# EAGLE design I2CSlave_OnBoard (EAGLE 8.3.1)
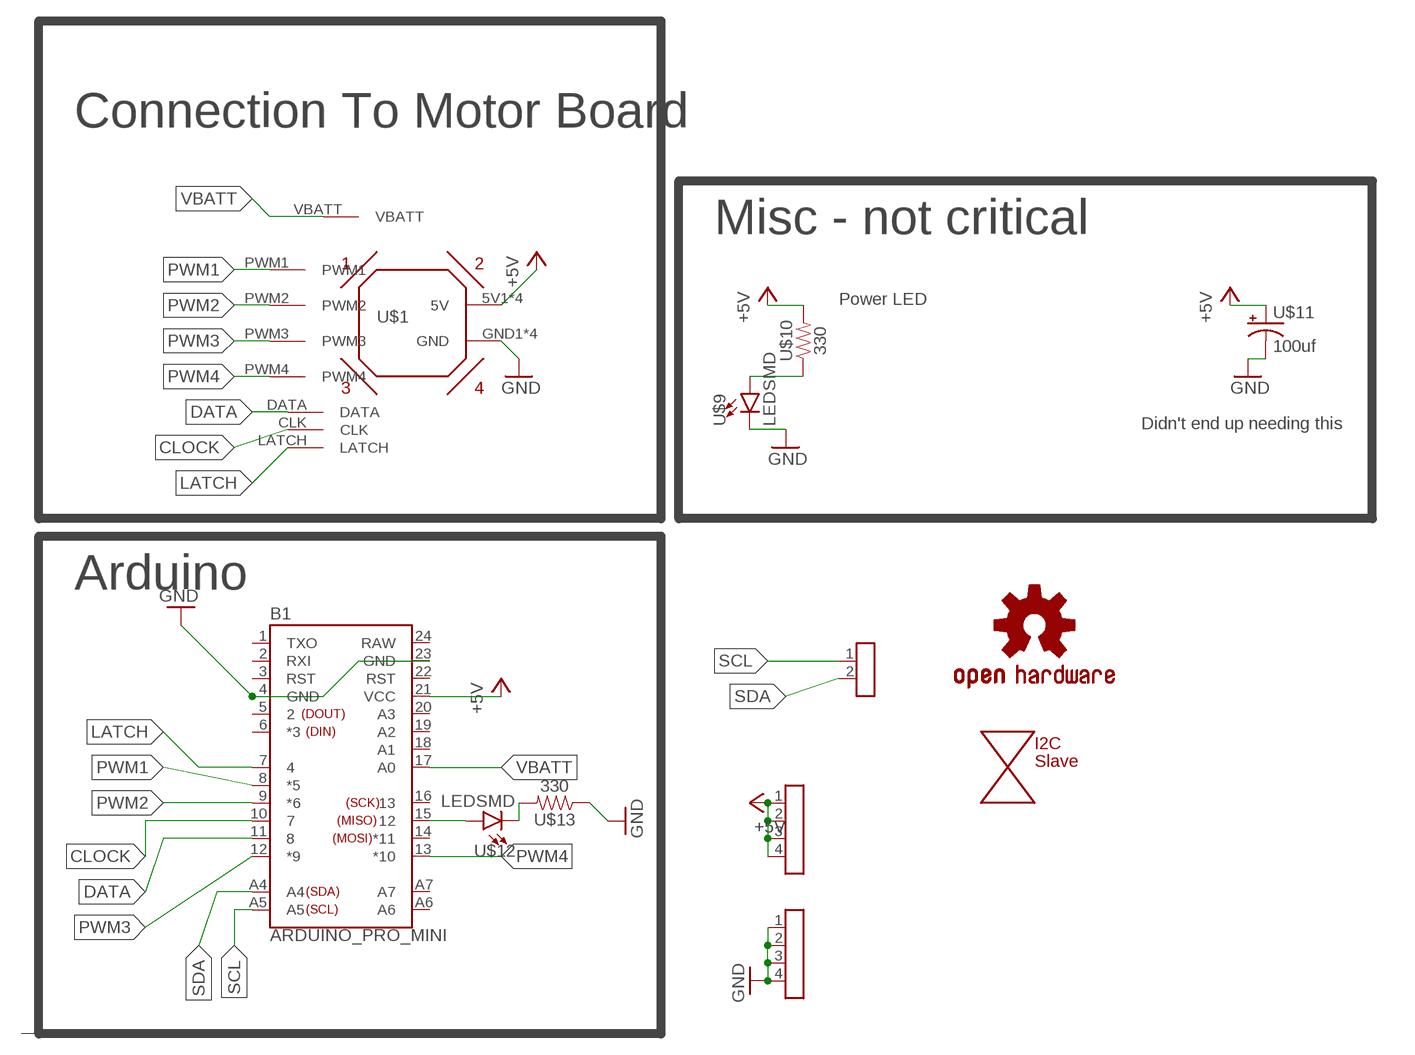
[diagram p0: schematic, sheet 1]

## Parts
B1  ARDUINO_PRO_MINI  [ARDUINO_PRO_MINI]
I2C  Slave  ANNOTATION  [ANNOTATION]
LOGO1  OSHW-LOGOM  [OSHW-LOGO-M]
U$1  OMNIBOARD  [OMNIBOARD]
U$2  2XHEADER  [2XHEADER]
U$3  4XHEADER  [4XHEADER]
U$4  4XHEADER  [4XHEADER]
U$9  LEDSMD  [LED_SMD]
U$10  330  RESISTORSMD  [R1206]
U$11  100uf  CAP_EMED  [CAP_E]
U$12  LEDSMD  [LED_SMD]
U$13  330  RESISTORSMD  [R1206]

## Nets
+5V [pow]: B1.21(VCC) U$1.5V1(5V) U$1.5V2(5V) U$1.5V3(5V) U$1.5V4(5V) U$3.1 U$3.2 U$3.3 U$3.4 U$10.2 U$11.+
CLOCK: B1.10 U$1.CLK
DATA: B1.11 U$1.DATA
GND [pow]: B1.4(GND) B1.23(GND) U$1.GND1(GND) U$1.GND2(GND) U$1.GND3(GND) U$1.GND4(GND) U$4.1 U$4.2 U$4.3 U$4.4 U$9.C U$11.- U$13.1
LATCH: B1.7 U$1.LATCH
N$1: U$9.A U$10.1
N$2: B1.15 U$12.A
N$5: U$12.C U$13.2
PWM1: B1.8(*5) U$1.PWM1
PWM2: B1.9(*6) U$1.PWM2
PWM3: B1.12(*9) U$1.PWM3
PWM4: B1.13(*10) U$1.PWM4
SCL: B1.A5 U$2.1
SDA: B1.A4 U$2.2
VBATT: B1.17(A0) U$1.VBATT
Unconnected: B1.1(TXO) B1.2(RXI) B1.3(RST) B1.5 B1.6(*3) B1.14(*11) B1.16 B1.18(A1) B1.19(A2) B1.20(A3) B1.22(RST) B1.A6 B1.A7

## Notes on the sheet
- Connection To Motor Board
- Misc - not critical
- Power LED
- Didn't end up needing this
- Arduino

## Power pins joined to a net without a drawn wire
RAW: B1.24(RAW)

## Library data of the parts
B1 = Richard_Micros:ARDUINO_PRO_MINI: SparkFun Pro Mini Pro Mini compatible footprint. Dimensions: 0.7 x 1.3" PCB Thickness: 0.8mm SparkFun Products: 3.3V/8MHz <https://www.sparkfun.com/products/11114> 5V/16MHz <https://www.sparkfun.com/products/11113>
I2C = Richard_Symbols:ANNOTATION
LOGO1 = Richard_Symbols:OSHW-LOGO: Open-Source Hardware (OSHW) Logo This logo indicates the piece of hardware it is found on incorporates a OSHW license and/or adheres to the definition of open source hardware found here: http://freedomdefined.org/OSHW
U$1 = Richard:OMNIBOARD
U$2 = Richard_Headers:2XHEADER
U$3 U$4 = Richard_Headers:4XHEADER
U$9 U$12 = Richard_Components:LED
U$10 U$13 = Richard_Components:RESISTOR
U$11 = Richard_Components:CAP_E

## Net classes
0 default: width 0.254 mm
1 pow: width 0.508 mm

## Board
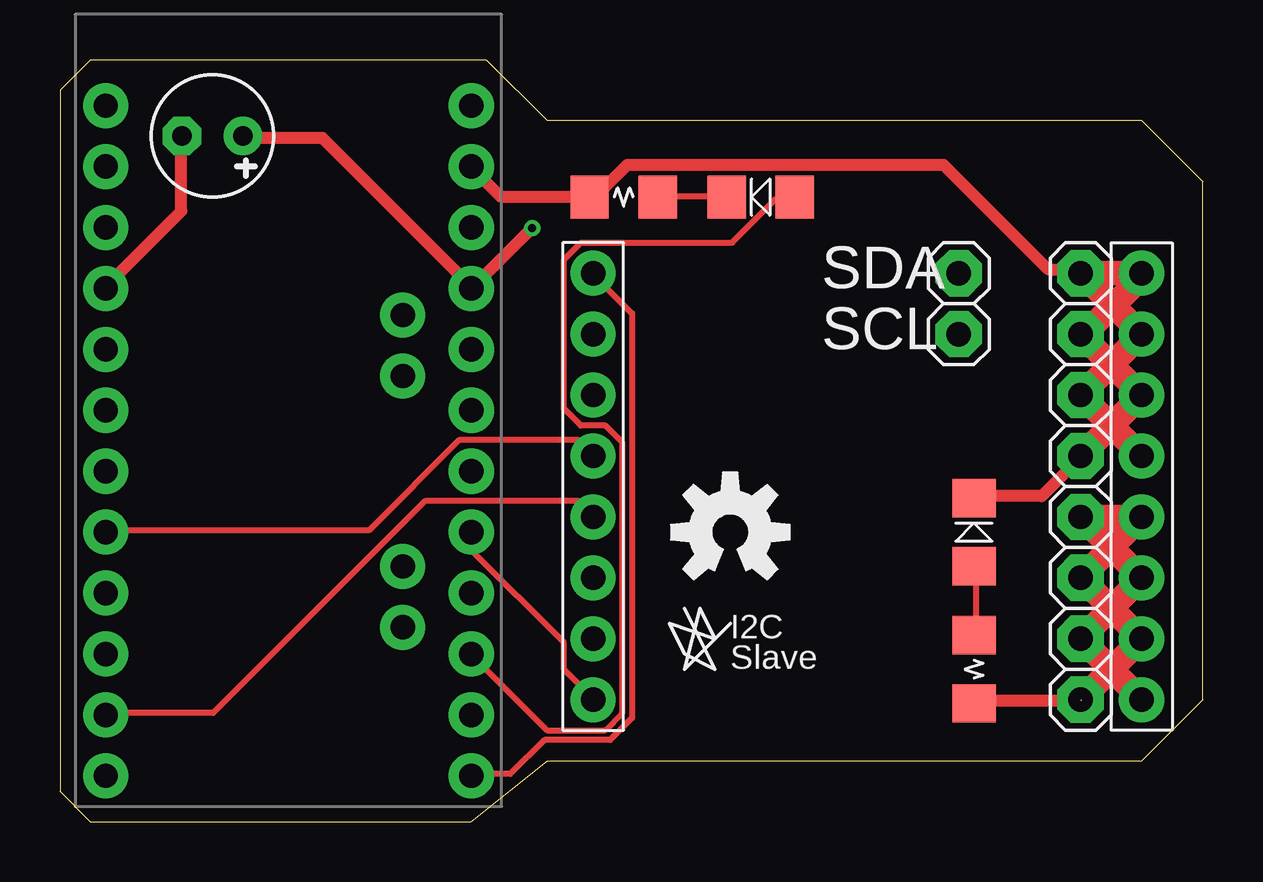
[diagram p1: board, top side]
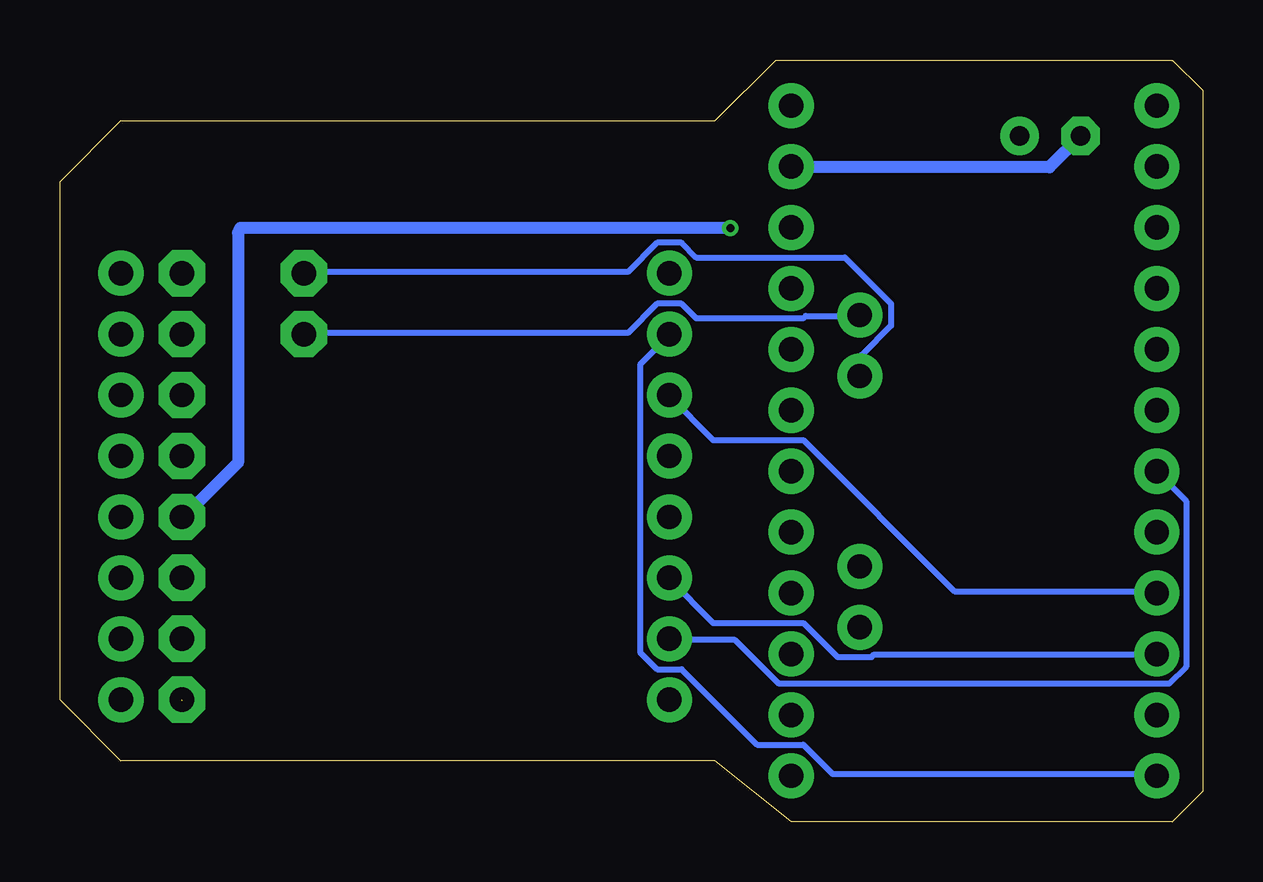
[diagram p2: board, bottom side, seen from below]

Size 47.62 x 31.75 mm. Coordinates in mm from the lower left corner, seen from the top.
Outline: 20.32,2.54 45.09,2.54 47.62,5.08 47.62,26.67 45.09,29.21 20.32,29.21 17.78,31.75 1.27,31.75 0,30.48 0,1.27 1.27,0 17.14,0 20.32,2.54
Copper layers (1*16): Top 0.0356mm / dielectric 1.5011mm / Bottom 0.0356mm
Design rules "LaenPCBOrder": minimum track width 6mil, minimum drill 13mil, track to track 6mil, track to pad 6mil, pad to pad 6mil, via to via 6mil, smd to smd 6mil, copper to edge 15mil, drill to drill 6mil, minimum pad ring 7mil, minimum via ring 7mil, stop-mask expansion 3mil, vias tented up to drill 0mil, thermal gap 10mil

### Footprints (pad centres in the part's own frame; a part is rotated, then mirrored left to right if it is on the bottom)
ARDUINO_PRO_MINI = drill 1.016 pad 1.88: 1 -7.62,12.7; 2 -7.62,10.16; 3 -7.62,7.62; 4 -7.62,5.08; 5 -7.62,2.54; 6 -7.62,0; 7 -7.62,-2.54; 8 -7.62,-5.08; 9 -7.62,-7.62; 10 -7.62,-10.16; 11 -7.62,-12.7; 12 -7.62,-15.24; 13 7.62,-15.24; 14 7.62,-12.7; 15 7.62,-10.16; 16 7.62,-7.62; 17 7.62,-5.08; 18 7.62,-2.54; 19 7.62,0; 20 7.62,2.54; 21 7.62,5.08; 22 7.62,7.62; 23 7.62,10.16; 24 7.62,12.7; A4 4.763,1.429; A5 4.763,3.969; A6 4.763,-9.049; A7 4.763,-6.509
OMNIBOARD = drill 1.016 pad 1.88: 5V1 11.43,-1.27; 5V2 11.43,-3.81; 5V3 11.43,-6.35; 5V4 11.43,-8.89; CLK -11.43,-3.81; DATA -11.43,-1.27; GND1 11.43,8.89; GND2 11.43,6.35; GND3 11.43,3.81; GND4 11.43,1.27; LATCH -11.43,-6.35; PWM1 -11.43,1.27; PWM2 -11.43,3.81; PWM3 -11.43,6.35; PWM4 -11.43,8.89; VBATT -11.43,-8.89
2XHEADER = drill 1.016 pad 1.93 octagon: 1 0,1.27; 2 0,-1.27
4XHEADER = drill 1.016 pad 1.93 octagon: 1 0,3.81; 2 0,1.27; 3 0,-1.27; 4 0,-3.81
LED_SMD = smd 1.6 x 1.803: A -1.422,0; C 1.422,0
R1206 = smd 1.6 x 1.803: 1 -1.422,0; 2 1.422,0
CAP_E = drill 0.813 pad 1.6: + -1.27,0 | drill 0.813 pad 1.6 octagon: - 1.27,0

### Placement (x,y rotation side)
B1  9.52,17.14 0 top
I2C  26.67,7.62 0 top
LOGO1  27.94,12.07 0 top
U$1  33.66,13.97 0 top
U$2  37.46,21.59 180 top
U$3  42.55,8.89 0 top
U$4  42.55,19.05 0 top
U$9  38.1,12.07 90 top
U$10  38.1,6.35 270 top
U$11  6.35,28.57 180 top
U$12  29.21,26.04 180 top
U$13  23.49,26.04 0 top

### Tracks (layer width: path | path; a pad name or v marks a point on that pad's centre or on a via)
+5V  (via drill 0.33)  (1 unrouted)
  Top 0.508: U$11.+ 7.7,28.5 10.95,28.5 17.14,22.3 B1.21 17.35,22.4 v19.69,24.74 | 42.55,5.03 38.18,5.03 U$10.2
  Top 1.016: U$1.5V4 U$3.3 U$1.5V2 U$3.1 U$1.5V1 U$3.2 U$1.5V3 U$3.4
  Bottom 0.508: v19.69,24.74 40.11,24.74 40.21,24.54 40.21,14.96 42.55,12.62 U$3.1
CLOCK
  Bottom 0.254: B1.10 1.9,6.96 13.69,6.96 13.79,6.86 15.21,6.86 16.64,8.28 20.4,8.28 22.23,10.11 U$1.CLK
DATA
  Top 0.254: B1.11 1.9,4.52 6.38,4.52 15.21,13.36 21.62,13.36 22.23,12.75 U$1.DATA
GND
  Top 0.508: B1.23 17.14,27.28 18.36,26.06 22.02,26.06 U$13.1 22.33,26.06 23.65,27.38 36.83,27.38 41.2,23.01 42.34,23.01 U$4.1 | U$11.- 5.05,28.5 5.05,25.45 1.9,22.3 B1.4 | U$9.C 38.18,13.56 40.92,13.56 42.55,15.19 U$4.4
  Top 1.016: U$4.4 U$1.GND3 42.62,20.24 | U$1.GND4 U$4.3 U$1.GND2 U$4.1 U$1.GND1 45.09,22.71 42.62,20.24 | 42.62,20.24 U$4.2
  Bottom 0.508: U$11.- 6.38,27.28 17.14,27.28 B1.23
LATCH
  Bottom 0.254: U$1.LATCH 22.23,7.57 19.48,7.57 17.65,5.74 1.4,5.74 0.69,6.45 0.69,13.36 1.9,14.58 B1.7
N$1
  Top 0.254: U$10.1 38.18,7.77 38.18,10.62 U$9.A
N$2
  Top 0.254: U$12.A 30.56,25.96 29.84,25.96 28.02,24.13 21.72,24.13 21.01,23.42 21.01,17.22 21.72,16.51 22.73,16.51 23.44,15.8 23.44,4.52 22.73,3.81 20.3,3.81 17.14,6.96 B1.15
N$5
  Top 0.254: U$13.2 24.97,26.06 27.71,26.06 U$12.C
PWM1
  Top 0.254: B1.8 1.9,12.14 12.88,12.14 16.64,15.9 21.62,15.9 22.23,15.29 U$1.PWM1
PWM2
  Bottom 0.254: B1.9 1.9,9.6 10.34,9.6 16.64,15.9 20.4,15.9 22.23,17.73 U$1.PWM2
PWM3
  Bottom 0.254: B1.12 1.9,1.98 15.42,1.98 16.64,3.2 18.57,3.2 21.72,6.35 22.73,6.35 23.44,7.06 23.44,19.05 22.23,20.27 U$1.PWM3
PWM4
  Top 0.254: B1.13 17.14,1.98 18.77,1.98 20.19,3.4 22.94,3.4 23.85,4.32 23.85,21.18 22.23,22.81 U$1.PWM4
SCL
  Bottom 0.254: B1.A5 14.3,21.08 16.54,21.08 16.64,20.98 21.11,20.98 21.72,21.59 22.73,21.59 23.95,20.37 37.46,20.37 U$2.1
SDA
  Bottom 0.254: B1.A4 14.2,18.64 14.2,19.46 12.98,20.68 12.98,21.59 14.91,23.52 21.11,23.52 21.72,24.13 22.73,24.13 23.95,22.91 37.46,22.91 U$2.2
VBATT
  Top 0.254: B1.17 17.14,11.33 21.01,7.47 21.01,6.35 22.23,5.13 U$1.VBATT

### Text on the board
tPlace: SDA | SCL